# Altium schematic sheet Sheet1.SchDoc: MIMI Arduino Smart Watch
size A3; Author: MinSik. Kim; DrawnBy: MinSik. Kim; Engineer: MinSik. Kim; Revision: v1.0; DocumentName: MIMI Arduino Smart Watch; Rule: PcbType=ProtelPcb
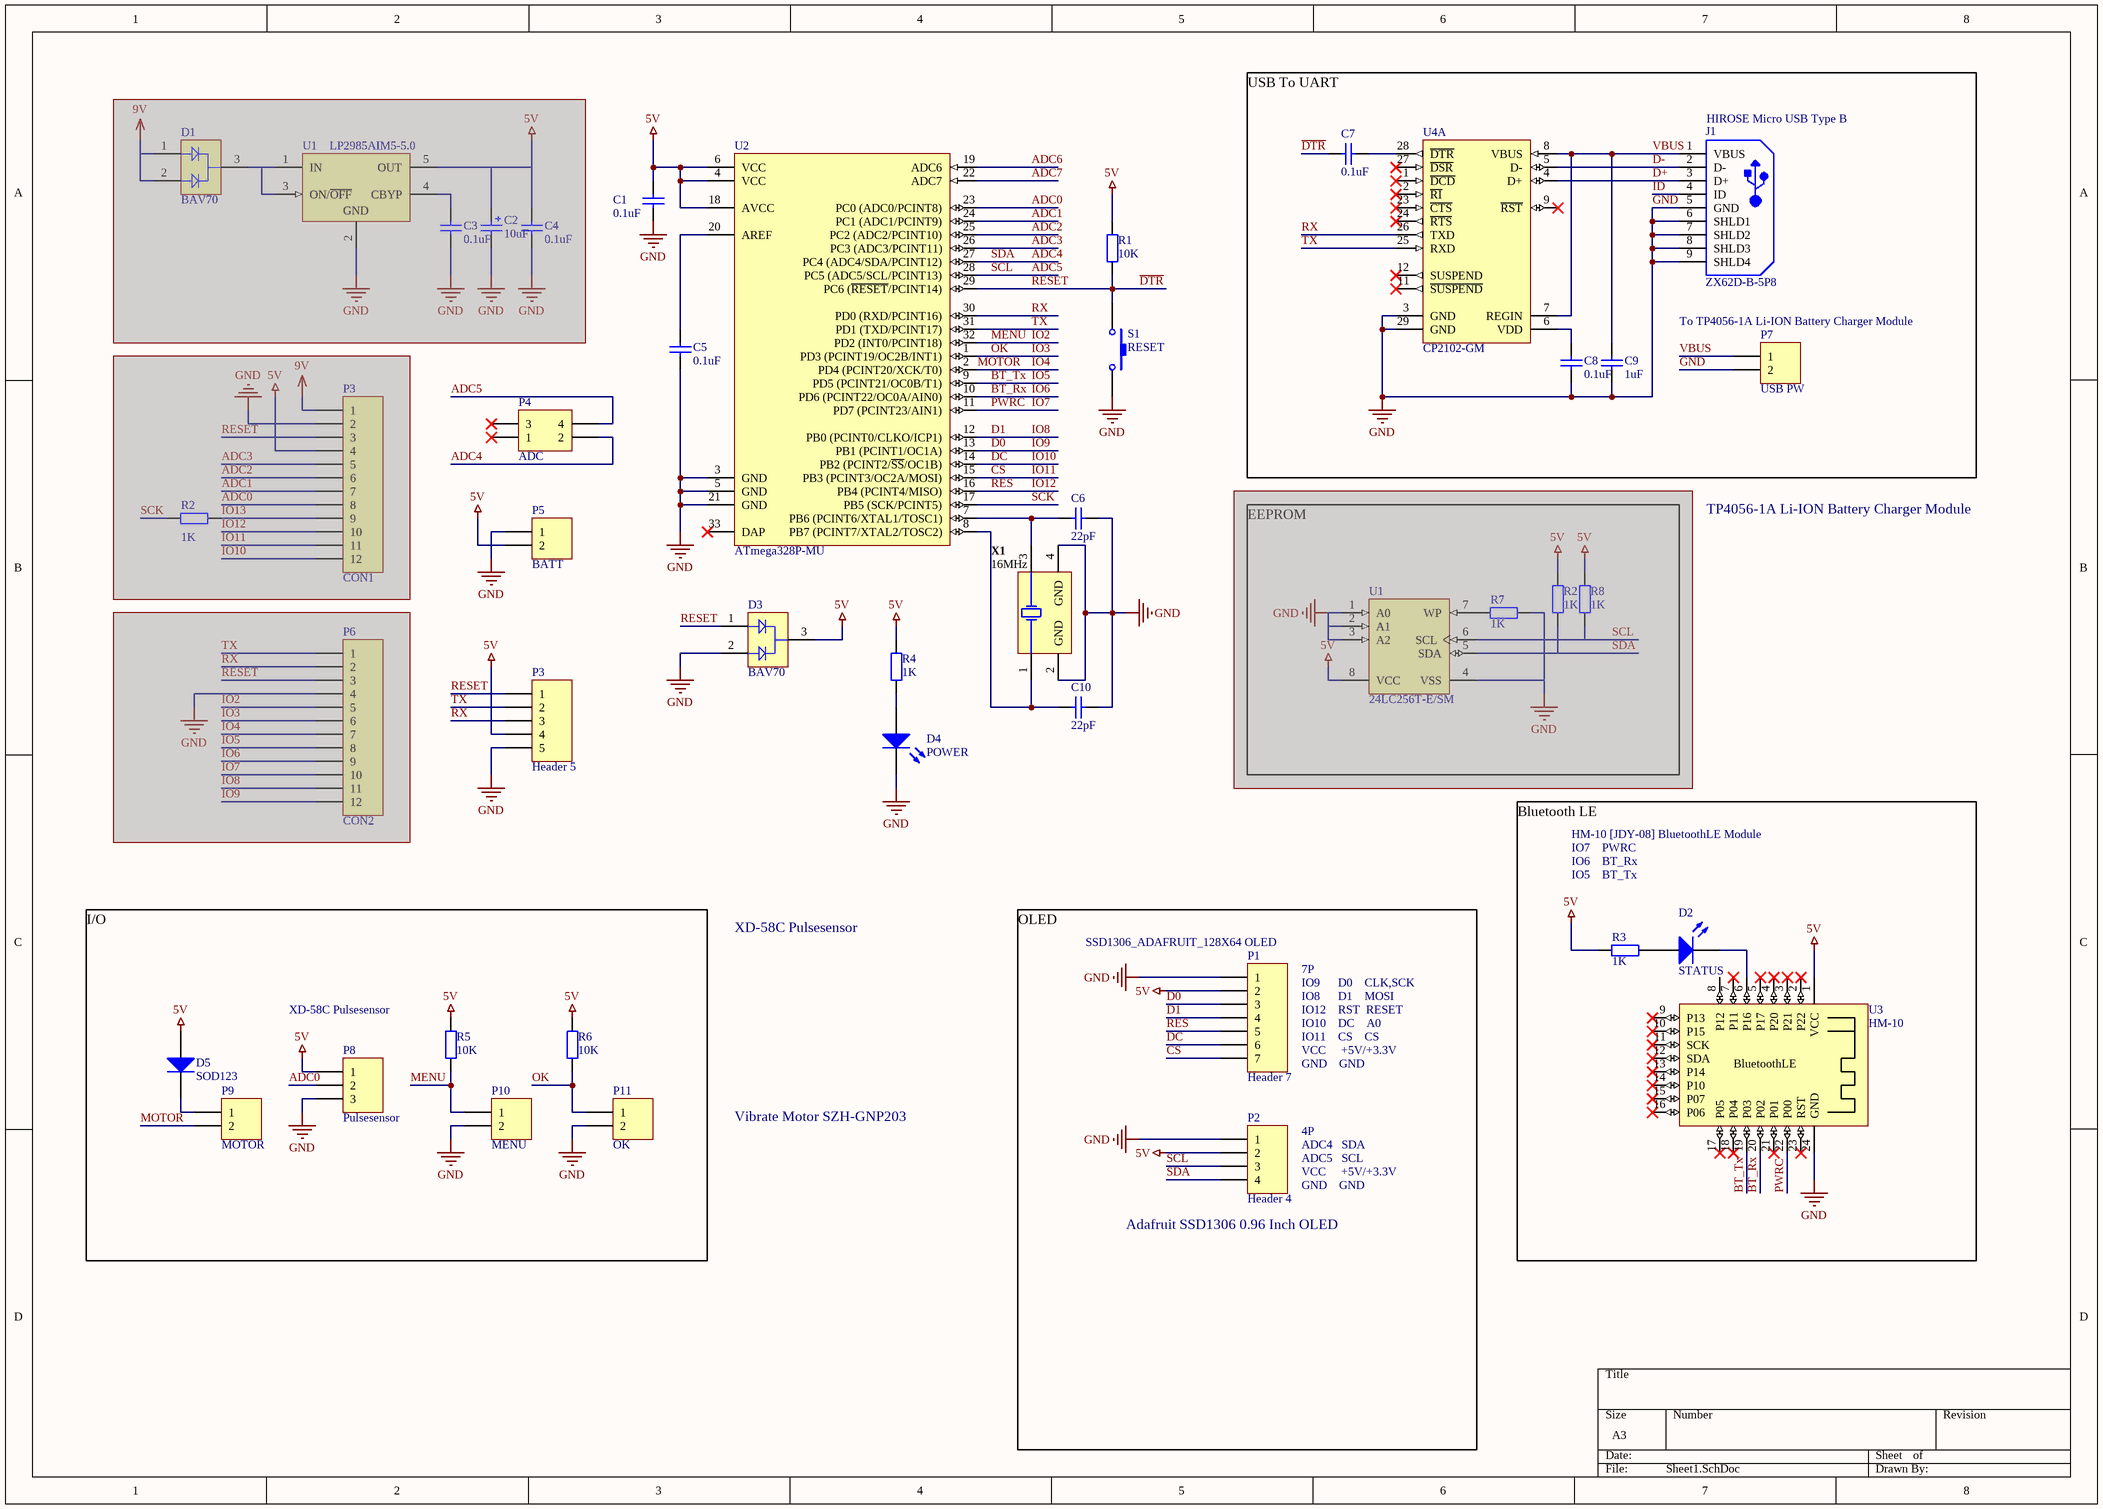
[diagram p0: Sheet1.SchDoc]

## Parts
(Parts that share a designator on the sheet are numbered #1, #2 ... from top to bottom, then left to right.)
C1  value 0.1uF  [1608[0603]]  (hidden comment: Cap)
C2  value 10uF  [C1206]  (hidden comment: Cap Pol2)  (masked out: inside a compile mask, not in the netlist)
C3  value 0.1uF  [1608[0603]]  (hidden comment: Cap)  (masked out: inside a compile mask, not in the netlist)
C4  value 0.1uF  [1608[0603]]  (hidden comment: Cap)  (masked out: inside a compile mask, not in the netlist)
C5  value 0.1uF  [1608[0603]]  (hidden comment: Cap)
C6  value 22pF  [1608[0603]]  (hidden comment: Cap)
C7  value 0.1uF  [1608[0603]]  (hidden comment: Cap)
C8  value 0.1uF  [1608[0603]]  (hidden comment: Cap)
C9  value 1uF  [1608[0603]]  (hidden comment: Cap)
C10  value 22pF  [1608[0603]]  (hidden comment: Cap)
D1  BAV70  [INF-SOT23_L]  (masked out: inside a compile mask, not in the netlist)
D2  STATUS  [3.2X1.6X1.1]
D3  BAV70  [INF-SOT23_L]
D4  POWER  [3.2X1.6X1.1]
D5  SOD123  [MCC-SOD123_V]
J1  ZX62D-B-5P8  [HIRO-ZX62D-B-5P8_V]
P1  Header 7  [HDR1X7]
P2  Header 4  [HDR1X4]
P3#1  CON1  [HDR1X12]  (masked out: inside a compile mask, not in the netlist)
P3#2  Header 5  [HDR1X5]
P4  ADC  [HDR2X2]
P5  BATT  [HDR1X2]
P6  CON2  [HDR1X12]  (masked out: inside a compile mask, not in the netlist)
P7  USB PW  [HDR1X2]
P8  Pulsesensor  [HDR1X3]
P9  MOTOR  [HDR1X2]
P10  MENU  [HDR1X2]
P11  OK  [HDR1X2]
R1  value 10K  [J1-0603]  (hidden comment: Res2)
R2#1  value 1K  [J1-0603]  (hidden comment: Res2)  (masked out: inside a compile mask, not in the netlist)
R2#2  value 1K  [J1-0603]  (hidden comment: Res2)  (masked out: inside a compile mask, not in the netlist)
R3  value 1K  [J1-0603]  (hidden comment: Res2)
R4  value 1K  [J1-0603]  (hidden comment: Res2)
R5  value 10K  [J1-0603]  (hidden comment: Res2)
R6  value 10K  [J1-0603]  (hidden comment: Res2)
R7  value 1K  [J1-0603]  (hidden comment: Res2)  (masked out: inside a compile mask, not in the netlist)
R8  value 1K  [J1-0603]  (hidden comment: Res2)  (masked out: inside a compile mask, not in the netlist)
S1  RESET  [SW]
U1#1  LP2985AIM5-5.0  [DBV0005A_L]  (masked out: inside a compile mask, not in the netlist)
U1#2  24LC256T-E/SM  [SOIJ-SM8_M]  (masked out: inside a compile mask, not in the netlist)
U2  ATmega328P-MU  [32M1-A_L]
U3  HM-10  [HM-10]
U4  CP2102-GM  [SLAB-QFN-28-3125x3125TP_N]  (part A of 2)
X1  16MHz  [TSX-3225]

## Nets
5V: C1.2 D3.3(K) D5.1(A) P1.2 P2.2 P3#2.4 P5.2 P8.1 R1.2 R3.2 R4.2 R5.2 R6.2 U2.4(VCC) U2.6(VCC) U2.18(AVCC) U3.1(VCC)
GND: C1.1 C5.1 C6.1 C8.2 C9.2 C10.1 D3.2(A2) D4.2(K) J1.5(GND) J1.6(SHLD1) J1.7(SHLD2) J1.8(SHLD3) J1.9(SHLD4) P1.1 P2.1 P3#2.5 P5.1 P7.2 P8.3 P10.2 P11.2 S1.2 U2.3(GND) U2.5(GND) U2.21(GND) U3.24(GND) U4.3(GND) U4.29(GND) X1.2(GND) X1.4(GND)
ADC0: P8.2 U2.23(PC0_(ADC0/PCINT8))
ADC1: U2.24(PC1_(ADC1/PCINT9))
ADC2: U2.25(PC2_(ADC2/PCINT10))
ADC3: U2.26(PC3_(ADC3/PCINT11))
ADC4: P2.4 P4.2 U2.27(PC4_(ADC4/SDA/PCINT12))  [also labelled SDA]
ADC5: P2.3 P4.4 U2.28(PC5_(ADC5/SCL/PCINT13))  [also labelled SCL]
ADC6: U2.19(ADC6)
ADC7: U2.22(ADC7)
BT_Rx: U2.10(PD6_(PCINT22/OC0A/AIN0)) U3.20(P02)  [also labelled IO6]
BT_Tx: U2.9(PD5_(PCINT21/OC0B/T1)) U3.19(P03)  [also labelled IO5]
CS: P1.7 U2.15(PB3_(PCINT3/OC2A/MOSI))  [also labelled IO11]
D0: P1.3 U2.13(PB1_(PCINT1/OC1A))  [also labelled IO9]
D1: P1.4 U2.12(PB0_(PCINT0/CLKO/ICP1))  [also labelled IO8]
D+: J1.3(D+) U4.4(D+)
D-: J1.2(D-) U4.5(D-)
~{DTR}: C7.1 D3.1(A1) P3#2.1 R1.1 S1.1 U2.29(PC6_(~{RESET}/PCINT14))  [also labelled RESET]
DC: P1.6 U2.14(PB2_(PCINT2/~{SS}/OC1B))  [also labelled IO10]
ID: J1.4(ID)
IO2: P10.1 R5.1 U2.32(PD2_(INT0/PCINT18))  [also labelled MENU]
IO3: P11.1 R6.1 U2.1(PD3_(PCINT19/OC2B/INT1))  [also labelled OK]
IO4: P9.2 U2.2(PD4_(PCINT20/XCK/T0))  [also labelled MOTOR]
IO7: U2.11(PD7_(PCINT23/AIN1)) U3.22(P00)  [also labelled PWRC]
IO12: P1.5 U2.16(PB4_(PCINT4/MISO))  [also labelled RES]
RX: P3#2.3 U2.30(PD0_(RXD/PCINT16)) U4.26(TXD)
SCK: U2.17(PB5_(SCK/PCINT5))
TX: P3#2.2 U2.31(PD1_(TXD/PCINT17)) U4.25(RXD)
VBUS: C9.1 J1.1(VBUS) P7.1 U4.7(REGIN) U4.8(VBUS)
NetC5_2: C5.2 U2.20(AREF)
NetC6_2: C6.2 U2.7(PB6_(PCINT6/XTAL1/TOSC1)) X1.3(X2)
NetC7_2: C7.2 U4.28(~{DTR})
NetC8_1: C8.1 U4.6(VDD)
NetC10_2: C10.2 U2.8(PB7_(PCINT7/XTAL2/TOSC2)) X1.1(X1)
NetD2_1: D2.1(A) R3.1
NetD2_2: D2.2(K) U3.6(P16)
NetD4_1: D4.1(A) R4.1
NetD5_2: D5.2(K) P9.1

Not connected (* = marked no-connect by the designer): P4 1* 3*; U2 33(DAP)*; U3 2(P22)* 3(P21)* 4(P20)* 5(P17)* 7(P11)* 8(P12) 9(P13)* 10(P15)* 11(SCK)* 12(SDA)* 13(P14)* 14(P10)* 15(P07)* 16(P06)* 17(P05)* 18(P04)* 21(P01)* 23(RST)*; U4 1(~{DCD})* 2(~{RI})* 9(~{RST})* 11(~{SUSPEND})* 12(SUSPEND)* 23(~{CTS})* 24(~{RTS})* 27(~{DSR})*

## Notes on the sheet
- (near J1) HIROSE Micro USB Type B
- (near P7) To TP4056-1A Li-ION Battery Charger Module
- USB To UART
- TP4056-1A Li-ION Battery Charger Module
- EEPROM
- HM-10 [JDY-08] BluetoothLE Module
- IO7    PWRC
- IO6    BT_Rx
- IO5    BT_Tx
- XD-58C Pulsesensor
- (near P1) SSD1306_ADAFRUIT_128X64 OLED
- IO9      D0    CLK,SCK
- 7P
- IO8      D1    MOSI
- IO12    RST  RESET
- IO10    DC    A0
- IO11    CS    CS
- VCC     +5V/+3.3V
- Vibrate Motor SZH-GNP203
- GND    GND
- ADC4   SDA
- ADC5   SCL
- 4P
- I/O
- (near P2) Adafruit SSD1306 0.96 Inch OLED
- Bluetooth LE
- OLED
- (in symbol HM-10) BluetoothLE

## Library data of the parts
C1 C3-C10 = Cap: Capacitor; Published: 8-Jun-2000; LatestRevisionDate: 17-Jul-2002; LatestRevisionNote: Re-released for DXP Platform.; PackageReference: RAD-0.3; Publisher: Altium Limited; PackageDescription: Radial Cap, Thru-Hole; 2 Leads; 0.3 in Pin Spacing
C2 = Cap Pol2: Polarized Capacitor (Axial); Published: 8-Jun-2000; LatestRevisionDate: 17-Jul-2002; LatestRevisionNote: Re-released for DXP Platform.; PackageReference: POLAR0.8; Publisher: Altium Limited; PackageDescription: Polarized Capacitor; 2 Leads
D1 D3 = CMP-1176-00013-1: Silicon Switching Diode, SOT23, Reel, Green; Manufacturer: Infineon; trr (max): 4Â ns; VBR (min): 85Â V; IF (max): 200Â mA; IR (max): 150Â nA; Configuration: Dual; Green: TRUE; VR (max): 80Â V; VF (max): 1.25Â V; ComponentLink3Description: Package Specification; PartNumber: BAV70; PackageVersion: Apr-08; ComponentLink3URL: http://www.infineon.com/dgdl/SOT23-Package_Overview.pdf?folderId=db3a30431936bc4b0119532290053c66&fileId=db3a30431936bc4b0119533468123c85; ComponentLink2URL: http://www.infineon.com/dgdl/bav70series.pdf?folderId=db3a30431400ef6801141b5844e103ea&fileId=db3a30431400ef6801141c0ba40e041d; PackageReference: SOT23; PackageDescription: 3-Pin Small Outline Transistor Package, 1.3 x 2.9 mm Body, 0.95 mm Pitch; ComponentLink1Description: Manufacturer URL; Mounting Technology: Surface Mount; ComponentLink1URL: http://www.infineon.com/; ComponentLink2Description: Datasheet
D2 D4 = LED3: Typical BLUE SiC LED; Published: 8-Jun-2000; LatestRevisionDate: 17-Dec-2003; LatestRevisionNote: PCB Footprint replaced.; DatasheetVersion: 16-Apr-2002; PackageVersion: 16-Apr-2002; PackageReference: 3.5X2.8X1.9; Publisher: Altium Limited; PackageDescription: SM LED; 2 C-Bend Leads; Body 3.5 x 2.8 x 1.9 mm, inc leads (LxWxH typ)
D5 = CMP-0862-00001-1: Switching Diode, 500 mW, 100 V, -55 to 150 degC, SOD123, RoHS, Tape and Reel; PartNumber: 1N4448W-TP; Manufacturer: Micro Commercial Components; FV: 1 V Max.; Trr: 4 nS; IF (AV): 250 mA; VRM (PRV): 100 V; PD: 500 mW; Typical Junction Capacitance: 4 pF; IR: 25 nA; ComponentLink1Description: Manufacturer URL; PackageVersion: Rev. C; ComponentLink2URL: http://www.mccsemi.com/up_pdf/1N4448W(SOD-123).pdf; DatasheetVersion: Rev. C; ComponentLink3Description: Package Specification; PackageDescription: 2-Pin SOD123, Body 2.7 x 1.6 mm, Height 1.35 mm; ComponentLink3URL: http://www.mccsemi.com/up_pdf/1N4448W(SOD-123).pdf; Operating Temperature Range: -55 to 150 degC; PackageReference: SOD123; Packing: Tape and Reel; ComponentLink1URL: http://www.mccsemi.com/; RoHS: TRUE; ComponentLink2Description: Datasheet; Mounting Technology: Surface Mount
J1 = CMP-0029-00002-1: Right Angle Receptacle Connector, Micro USB, 30 V(AC), -30 to 85 degC, 5-Pin SMD, RoHS, Tape and Reel; Capacitance: 1 uF; Tolerance: 10%; ESR: 7.5 Ohm; Voltage Rating: 35 V; PackageDescription: USB Connector, 5 Position Surface Mount, Length 8 mm, Height 2.65 mm; DatasheetVersion: Aug-16; REACH SVHC: No SVHC; Package Quantity: 2000; ComponentLink1Description: Manufacturer URL; ComponentLink2URL: https://www.hirose.com/product/en/download_file/key_name/ZX62D-B-5P8/category/Catalog/doc_file_id/31704/?file_category_id=5&item_id=02420034000&is_series=; Length: 3.2 mm; ComponentLink1URL: https://www.hirose.com; Radiation Hardening: No; Height: 1.8 mm; Max Operating Temperature: 125degC; Weight: 0.000571 oz; Min Operating Temperature: -55degC; ComponentLink3Description: Package Specification; Width: 1.6 mm; Case Code (Metric): 3216; Mount: Surface Mount; ComponentLink2Description: Datasheet; Case Code (Imperial): 1206; ComponentLink3URL: https://www.hirose.com/product/en/download_file/key_name/ZX62D-B-5P8/category/Drawing%20(2D)/doc_file_id/36535/?file_category_id=6&item_id=02420034000&is_series=; Pins: 2; Resistance: 7.5 Ohm; Packaging: Tape and Reel; RoHSCompliant: True; Voltage Rating (DC): 35 V; Case/Package: 1206; PackageReference: ZX62D-B-5P8
P1 = Header 7: Header, 7-Pin; LatestRevisionDate: 17-Jul-2002; LatestRevisionNote: Re-released for DXP Platform.; Publisher: Altium Limited
P2 = Header 4: Header, 4-Pin; LatestRevisionDate: 17-Jul-2002; LatestRevisionNote: Re-released for DXP Platform.; Publisher: Altium Limited
P3#1 P6 = Header 12: Header, 12-Pin; LatestRevisionDate: 17-Jul-2002; LatestRevisionNote: Re-released for DXP Platform.; Publisher: Altium Limited
P3#2 = Header 5: Header, 5-Pin; LatestRevisionDate: 17-Jul-2002; LatestRevisionNote: Re-released for DXP Platform.; Publisher: Altium Limited
P4 = Header 2X2: Header, 2-Pin, Dual row; LatestRevisionDate: 17-Jul-2002; LatestRevisionNote: Re-released for DXP Platform.; Publisher: Altium Limited
P5 P7 P9-P11 = Header 2: Header, 2-Pin; LatestRevisionDate: 17-Jul-2002; LatestRevisionNote: Re-released for DXP Platform.; Publisher: Altium Limited
P8 = Header 3: Header, 3-Pin; LatestRevisionDate: 17-Jul-2002; LatestRevisionNote: Re-released for DXP Platform.; Publisher: Altium Limited
R1 R2#1 R2#2 R3-R8 = Res2: Resistor; Published: 8-Jun-2000; LatestRevisionDate: 17-Jul-2002; LatestRevisionNote: Re-released for DXP Platform.; PackageReference: AXIAL-0.4; Publisher: Altium Limited; PackageDescription: Axial Device, Thru-Hole; 2 Leads; 0.4 in Pin Spacing
S1 = SW-PB: Switch; Published: 24-Mar-1999; LatestRevisionDate: 17-Jul-2002; LatestRevisionNote: Re-released for DXP Platform.; PackageReference: SPST-2; Publisher: Altium Limited; PackageDescription: Switch; 2 Leads
U1#1 = CMP-0062-01857-3: Micropower 150 mA Low-Noise Ultra Low-Dropout Regulator, 5-pin SOT-23; Manufacturer: Texas Instruments; PackageTopMarking: L0UA*XTT; PowerWise: N; CompType: LDO IC; PackageDescription: Molded SOT-23, .115 x .063 x .040 in Body, 5 Lead, .0375 in Pitch; PackageReference: DBV0005A; RoHS: N; ComponentLink1Description: Datasheet URL; ComponentLink1URL: http://www.ti.com/general/docs/lit/getliterature.tsp?genericPartNumber=LP2985-N&fileType=pdf; PinCount: 5
U1#2 = CMP-0159-00534-1: 256Kbit, 400kHz, 2.5V, I2C Serial EEPROM, 8-Pin SOIC 208mil, Extended Temperature, Tape and Reel; PackageDescription: 8-Lead Plastic Small Outline (SM) - Medium, 5.28 mm Body [SOIJ]; PackageVersion: revBB, Aug-2009; DatasheetVersion: revP, Oct-2007; PackageReference: SOIJ-SM8
U2 = CMP-0095-00077-2: 8-bit AVR Microcontroller, 32KB Flash, 1KB EEPROM, 2KB SRAM, 32-pin MLF, Industrial Grade (-40°C to 85°C); PackageReference: 32M1-A; ComponentLink2URL: http://www.atmel.com/dyn/resources/prod_documents/8271.pdf; DatasheetVersion: revD, May-2011; PackageVersion: revE, May-2006; ComponentLink3URL: http://www.atmel.com/dyn/resources/prod_documents/8271S.pdf; ComponentLink1URL: http://www.atmel.com/; PackageDescription: 32-Pin Micro Lead Frame Package (MLF),  5 x 5 x 1.0 mm Body, Pitch 0.50 mm, 3.10mm Exposed Pad; Code_JEDEC: MO-220-VHHD-2; RevisionNote: DatasheetVersion updated. URLs added.; ComponentLink1Description: Manufacturer URL; ComponentLink3Description: ATmega48A/48PA/88A/88PA/168A/168PA/328/328P Summary; ComponentLink2Description: ATmega48A/48PA/88A/88PA/168A/168PA/328/328P Datasheet
U3 = HM-10: Bluetooth Low Energy Module [JDY-08]
U4 = CMP-0511-00012-1: Single-Chip USB to UART Bridge, 1024 Bytes EEPROM, -40 to 85 degC, 28-pin QFN, Tube; Manufacturer: Silicon Labs; Internal Oscillator: TRUE; Sub-Family: USB Bridges; ComponentLink3Description: Package Specification; PackageDescription: 28-Pin Quad-Flat No-Leads Package, Body 5 x 5 mm, Pitch 0.5 mm; PartNumber: CP2102-GM; EEPROM: 1024 Bytes; Mounting Technology: Surface Mount; ComponentLink2URL: http://www.silabs.com/Support%20Documents/TechnicalDocs/CP2102-9.pdf; DatasheetVersion: Rev. 1.5; ComponentLink1URL: http://www.silabs.com/; ComponentLink2Description: Datasheet; Code_JEDEC: MO-220; PackageReference: QFN-28; Code_IPC: J-STD-020C; ComponentLink3URL: http://www.silabs.com/Support%20Documents/TechnicalDocs/C8051T61x.pdf; ComponentLink1Description: Manufacturer URL
X1 = XTAL-1-3-4